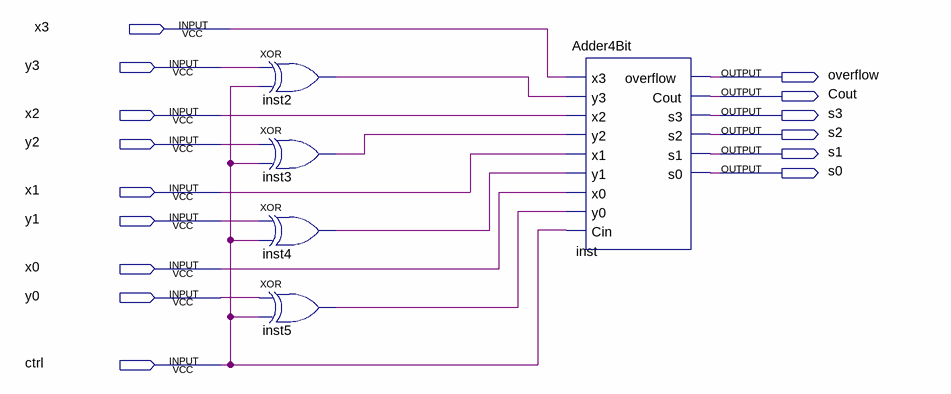
[diagram p0: schematic sheet]
// Quartus schematic lab7.bdf as structural Verilog: 5 symbols, 15 pins
module lab7 (
  input  x3,
  input  y3,
  input  x2,
  input  y2,
  input  x1,
  input  y1,
  input  x0,
  input  y0,
  input  ctrl,
  output overflow,
  output Cout,
  output s3,
  output s2,
  output s1,
  output s0
);

  wire inst2_out, inst3_out, inst4_out, inst5_out;

  xor inst2 (inst2_out, y3, ctrl);
  xor inst3 (inst3_out, y2, ctrl);
  xor inst4 (inst4_out, y1, ctrl);
  xor inst5 (inst5_out, y0, ctrl);
  Adder4Bit inst (
    .x3(x3), .y3(inst2_out), .x2(x2), .y2(inst3_out), .x1(x1), .y1(inst4_out), .x0(x0), .y0(inst5_out),
    .Cin(ctrl), .overflow(overflow), .Cout(Cout), .s3(s3), .s2(s2), .s1(s1), .s0(s0));
endmodule
